# EAGLE design MotionerIMU (EAGLE 6.3)
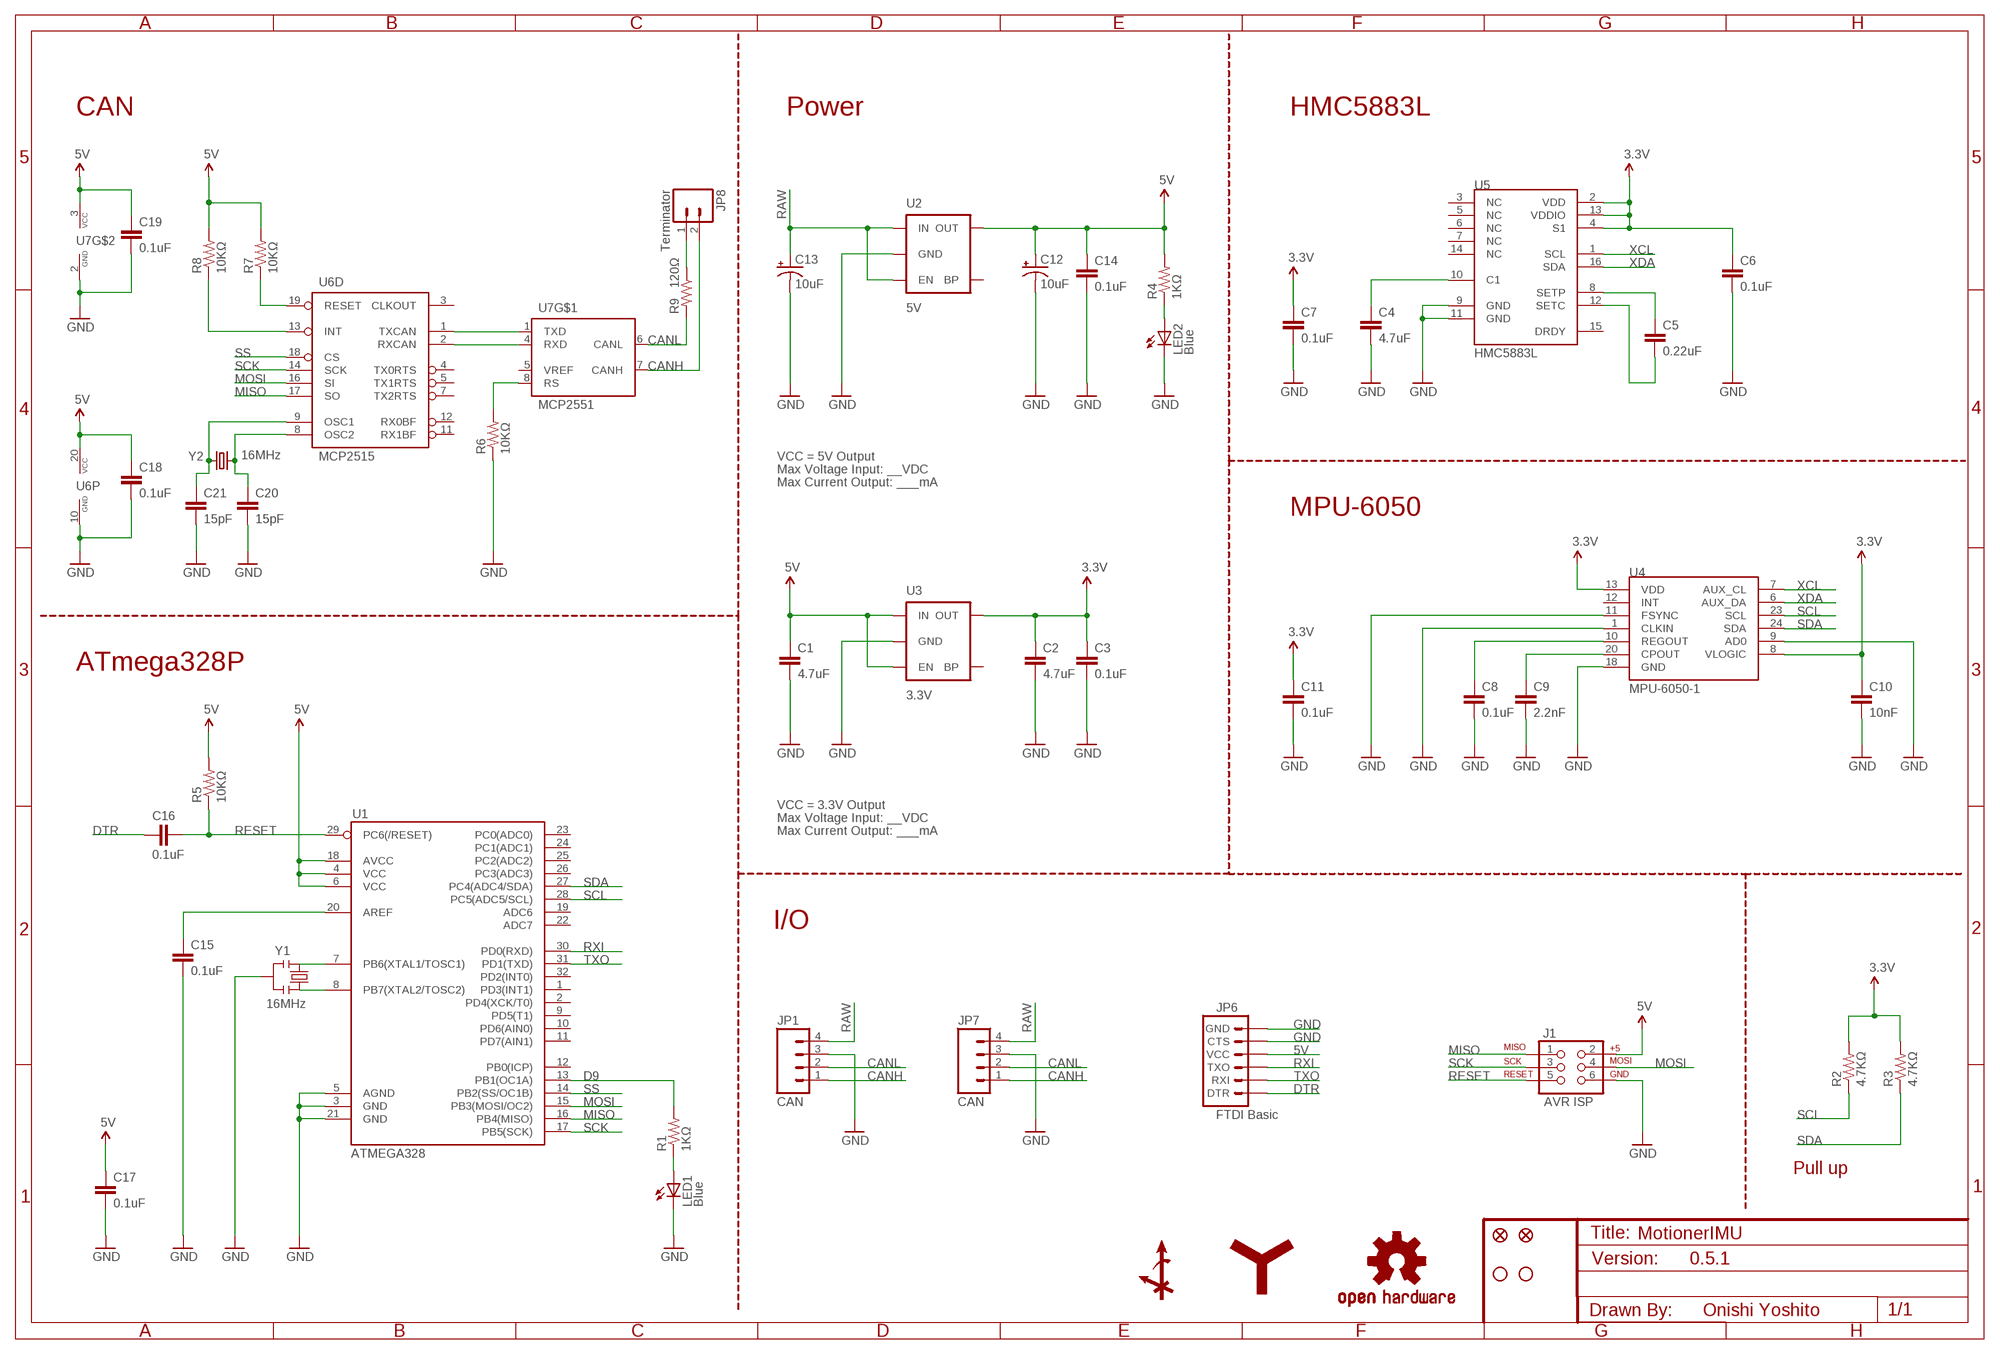
[diagram p0: schematic, sheet 1]

## Parts
C1  4.7uF  CAP0402-CAP  [0402-CAP]
C2  4.7uF  CAP0402-CAP  [0402-CAP]
C3  0.1uF  CAP0402-CAP  [0402-CAP]
C4  4.7uF  CAP0402-CAP  [0402-CAP]
C5  0.22uF  CAP0402-CAP  [0402-CAP]
C6  0.1uF  CAP0402-CAP  [0402-CAP]
C7  0.1uF  CAP0402-CAP  [0402-CAP]
C8  0.1uF  CAP0402-CAP  [0402-CAP]
C9  2.2nF  CAP0402-CAP  [0402-CAP]
C10  10nF  CAP0402-CAP  [0402-CAP]
C11  0.1uF  CAP0402-CAP  [0402-CAP]
C12  10uF  CAP_POL1206  [EIA3216]
C13  10uF  CAP_POL1206  [EIA3216]
C14  0.1uF  CAP0402-CAP  [0402-CAP]
C15  0.1uF  CAP0402-CAP  [0402-CAP]
C16  0.1uF  CAP0402-CAP  [0402-CAP]
C17  0.1uF  CAP0402-CAP  [0402-CAP]
C18  0.1uF  CAP0402-CAP  [0402-CAP]
C19  0.1uF  CAP0402-CAP  [0402-CAP]
C20  15pF  CAP0402-CAP  [0402-CAP]
C21  15pF  CAP0402-CAP  [0402-CAP]
J1  AVR ISP  AVR_SPI_PRG_6NS  [2X3-NS]
JP1  CAN  M04JST-PTH  [JST-4-PTH]
JP2  FIDUCIALUFIDUCIAL  [MICRO-FIDUCIAL]
JP3  STAND-OFFTIGHT  [STAND-OFF-TIGHT]
JP4  STAND-OFFTIGHT  [STAND-OFF-TIGHT]
JP5  FIDUCIALUFIDUCIAL  [MICRO-FIDUCIAL]
JP6  FTDI Basic  ARDUINO_SERIAL_PROGRAMPTH  [1X06]
JP7  CAN  M04JST-PTH  [JST-4-PTH]
JP8  Terminator  M02PTH  [1X02]
LED1  Blue  LED0603  [LED-0603]
LED2  Blue  LED0603  [LED-0603]
R1  1KΩ  RESISTOR0402-RES  [0402-RES]
R2  4.7KΩ  RESISTOR0402-RES  [0402-RES]
R3  4.7KΩ  RESISTOR0402-RES  [0402-RES]
R4  1KΩ  RESISTOR0402-RES  [0402-RES]
R5  10KΩ  RESISTOR0402-RES  [0402-RES]
R6  10KΩ  RESISTOR0402-RES  [0402-RES]
R7  10KΩ  RESISTOR0402-RES  [0402-RES]
R8  10KΩ  RESISTOR0402-RES  [0402-RES]
R9  120Ω  RESISTOR0402-RES  [0402-RES]
U1  ATMEGA328  ATMEGA168  [TQFP32-08]
U2  5V  V_REG_LDOSMD  [SOT23-5]
U3  3.3V  V_REG_LDOSMD  [SOT23-5]
U4  MPU-6050-1  [QFN-24-4MM2]
U5  HMC5883L  HMC5883LSMD  [16LPCC]
U6  MCP2515  MCP2515ST  [TSSOP20]
U7  MCP2551  MCP2551SO8  [SO08]
U$2  OSHW-LOGOS  [OSHW-LOGO-S]
U$11  AXIS-ANGLE_S  [AXIS-ANGLE_S]
U$13  YCAM_LOGO_L  [YCAM_LOGO_L]
Y1  16MHz  RESONATORSMD  [RESONATOR-SMD]
Y2  16MHz  CRYSTAL5X3  [CRYSTAL-SMD-5X3]

## Nets
3.3V [5V]: C2.1 C3.1 C6.1 C7.1 C10.1 C11.1 R2.2 R3.2 U3.5(OUT) U4.8(VLOGIC) U4.13(VDD) U5.2(VDD) U5.4(S1) U5.13(VDDIO)
5V [5V]: C1.1 C12.A(+) C14.1 C17.1 C18.1 C19.1 J1.2 JP6.4(VCC) R4.2 R5.2 R7.2 R8.2 U1.4(VCC) U1.6(VCC) U1.18(AVCC) U2.5(OUT) U3.1(IN) U3.3(EN) U6.20(P:VCC) U7.3(VCC)
CANH: JP1.1 JP7.1 JP8.2 U7.7(CANH)
CANL: JP1.2 JP7.2 R9.2 U7.6(CANL)
D9: R1.2 U1.13(PB1(OC1A))
DTR: C16.1 JP6.1(DTR)
GND [GND]: C1.2 C2.2 C3.2 C4.2 C6.2 C7.2 C8.2 C9.2 C10.2 C11.2 C12.C(-) C13.C(-) C14.2 C15.2 C17.2 C18.2 C19.2 C20.2 C21.2 J1.6 JP1.3 JP6.5(CTS) JP6.6(GND) JP7.3 LED1.C LED2.C R6.1 U1.3(GND) U1.5(AGND) U1.21(GND) U2.2(GND) U3.2(GND) U4.1(CLKIN) U4.9(AD0) U4.11(FSYNC) U4.18(GND) U5.9(GND) U5.11(GND) U6.10(P:GND) U7.2(GND) Y1.2
MISO: J1.1 U1.16(PB4(MISO)) U6.17(D:SO)
MOSI: J1.4 U1.15(PB3(MOSI/OC2)) U6.16(D:SI)
N$1: LED1.A R1.1
N$2: LED2.A R4.1
N$3: C4.1 U5.10(C1)
N$4: C5.1 U5.8(SETP)
N$5: C5.2 U5.12(SETC)
N$6: C9.1 U4.20(CPOUT)
N$7: C8.1 U4.10(REGOUT)
N$8: U1.7(PB6(XTAL1/TOSC1)) Y1.1
N$9: U1.8(PB7(XTAL2/TOSC2)) Y1.3
N$10: C15.1 U1.20(AREF)
N$11: U6.1(D:TXCAN) U7.1(TXD)
N$12: U6.2(D:RXCAN) U7.4(RXD)
N$13: R6.2 U7.8(RS)
N$14: R7.1 U6.19(D:RESET)
N$15: R8.1 U6.13(D:INT)
N$16: C20.1 U6.8(D:OSC2) Y2.3
N$17: C21.1 U6.9(D:OSC1) Y2.1
N$20: JP8.1 R9.1
RAW [RAW]: C13.A(+) JP1.4 JP7.4 U2.1(IN) U2.3(EN)
RESET: C16.2 J1.5 R5.1 U1.29(PC6(/RESET))
RXI: JP6.3(TXO) U1.30(PD0(RXD))
SCK: J1.3 U1.17(PB5(SCK)) U6.14(D:SCK)
SCL: R2.1 U1.28(PC5(ADC5/SCL)) U4.23(SCL)
SDA: R3.1 U1.27(PC4(ADC4/SDA)) U4.24(SDA)
SS: U1.14(PB2(SS/OC1B)) U6.18(D:CS)
TXO: JP6.2(RXI) U1.31(PD1(TXD))
XCL: U4.7(AUX_CL) U5.1(SCL)
XDA: U4.6(AUX_DA) U5.16(SDA)
Unconnected: U1.1(PD3(INT1)) U1.2(PD4(XCK/T0)) U1.9(PD5(T1)) U1.10(PD6(AIN0)) U1.11(PD7(AIN1)) U1.12(PB0(ICP)) U1.19(ADC6) U1.22(ADC7) U1.23(PC0(ADC0)) U1.24(PC1(ADC1)) U1.25(PC2(ADC2)) U1.26(PC3(ADC3)) U1.32(PD2(INT0)) U2.4(BP) U3.4(BP) U4.12(INT) U5.3(NC) U5.5(NC) U5.6(NC) U5.7(NC) U5.14(NC) U5.15(DRDY) U6.3(D:CLKOUT) U6.4(D:TX0RTS) U6.5(D:TX1RTS) U6.7(D:TX2RTS) U6.11(D:RX1BF) U6.12(D:RX0BF) U7.5(VREF)

## Notes on the sheet
- CAN | Power | HMC5883L
- VCC = 5V Output
- Max Voltage Input: __VDC
- Max Current Output: ___mA
- MPU-6050
- ATmega328P
- VCC = 3.3V Output
- Max Voltage Input: __VDC
- Max Current Output: ___mA
- I/O
- Pull up
- 0.5.1
- Onishi Yoshito

## Library data of the parts
C1-C11 C14-C21 = SparkFun-Passives:CAP: Capacitor Standard 0603 ceramic capacitor, and 0.1" leaded capacitor.
C12 C13 = SparkFun:CAP_POL: Capacitor Polarized These are standard SMD and PTH capacitors. Normally 10uF, 47uF, and 100uF in electrolytic and tantalum varieties. Always verify the external diameter of the through hole cap, it varies with capacity, voltage, and manufacturer. The EIA devices should be standard.
J1 = SparkFun-Connectors:AVR_SPI_PRG_6: AVR ISP 6 Pin This is the reduced ISP connector for AVR programming. Common on Arduino. This footprint will take up less PCB space and can be used with a 10-pin to 6-pin adapter such as SKU: BOB-08508
JP1 JP7 = SparkFun-Connectors:M04: Header 4 Standard 4-pin 0.1" header. Use with straight break away headers (SKU : PRT-00116), right angle break away headers (PRT-00553), swiss pins (PRT-00743), machine pins (PRT-00117), and female headers (PRT-00115). Molex polarized connector foot print use with SKU : PRT-08231 with associated crimp pins and housings. 1MM SMD Version SKU: PRT-10208
JP2 JP5 = SparkFun:FIDUCIAL: Fiducial Alignment Points Various fiducial points for machine vision alignment.
JP3 JP4 = SparkFun:STAND-OFF: Stand Off This is the mechanical footprint for a #4 phillips button head screw. Use the keepout ring to avoid running the screw head into surrounding components. SKU : PRT-00447
JP6 = SparkFun:ARDUINO_SERIAL_PROGRAM
JP8 = SparkFun-Connectors:M02: Header 2 Standard 2-pin 0.1" header. Use with straight break away headers (SKU : PRT-00116), right angle break away headers (PRT-00553), swiss pins (PRT-00743), machine pins (PRT-00117), and female headers (PRT-00115). Molex polarized connector foot print use with SKU : PRT-08233 with associated crimp pins and housings.
LED1 LED2 = SparkFun-LED:LED: LEDs Standard schematic elements and footprints for 5mm, 3mm, 1206, and 0603 sized LEDs. 5mm - Spark Fun Electronics SKU : COM-00529 (and others)
R1-R9 = SparkFun-Passives:RESISTOR: Resistor Basic schematic elements and footprints for 0603, 1206, and PTH resistors.
U1 = SparkFun:ATMEGA168
U2 U3 = SparkFun:V_REG_LDO: Voltage Regulator LDO Standard 150mA LDO voltage regulator in SOT-23 layout. Micrel part MIC5205. BP (by-pass) pin is used to lower output noise with 470pF cap.
U4 = Testing:MPU-6050
U5 = SparkFun-Sensors:HMC5883L: 3 Axis Digital Compass IC
U6 = can:MCP2515: MC2515 Stand-Alone CAN Controller With SPI Interface, Microchip
U7 = can:MCP2551: CAN Tranceiver Microchip
U$2 = SparkFun-Aesthetics:OSHW-LOGO: Open Source Hardware Logo This logo indicates the piece of hardware it is found on incorporates a OSHW license and/or adheres to the definition of open source hardware found here: http://freedomdefined.org/OSHW
U$11 = ram:AXIS-ANGLE_S
U$13 = ram:YCAM_LOGO_L
Y1 = SparkFun-FreqCtrl:RESONATOR: Resonator Small SMD resonator. This is the itty bitty 10/20MHz resonators with built in caps. CSTCE10M0G55 and CSTCE20M0V53. Footprint has been reviewed closely but hasn't been tested yet.
Y2 = SparkFun-FreqCtrl:CRYSTAL: Various standard crystals. Proven footprints. Spark Fun Electronics SKU : COM-00534

## Board
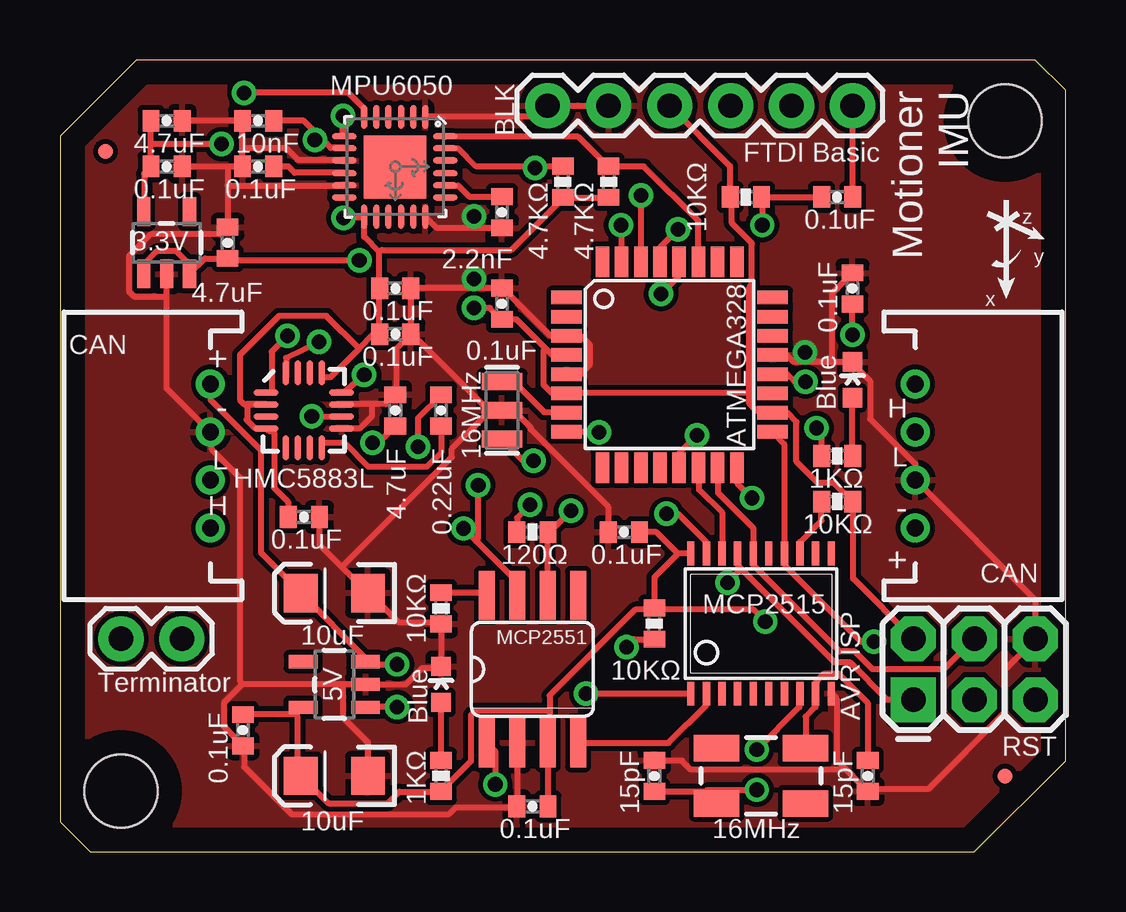
[diagram p1: board, top side]
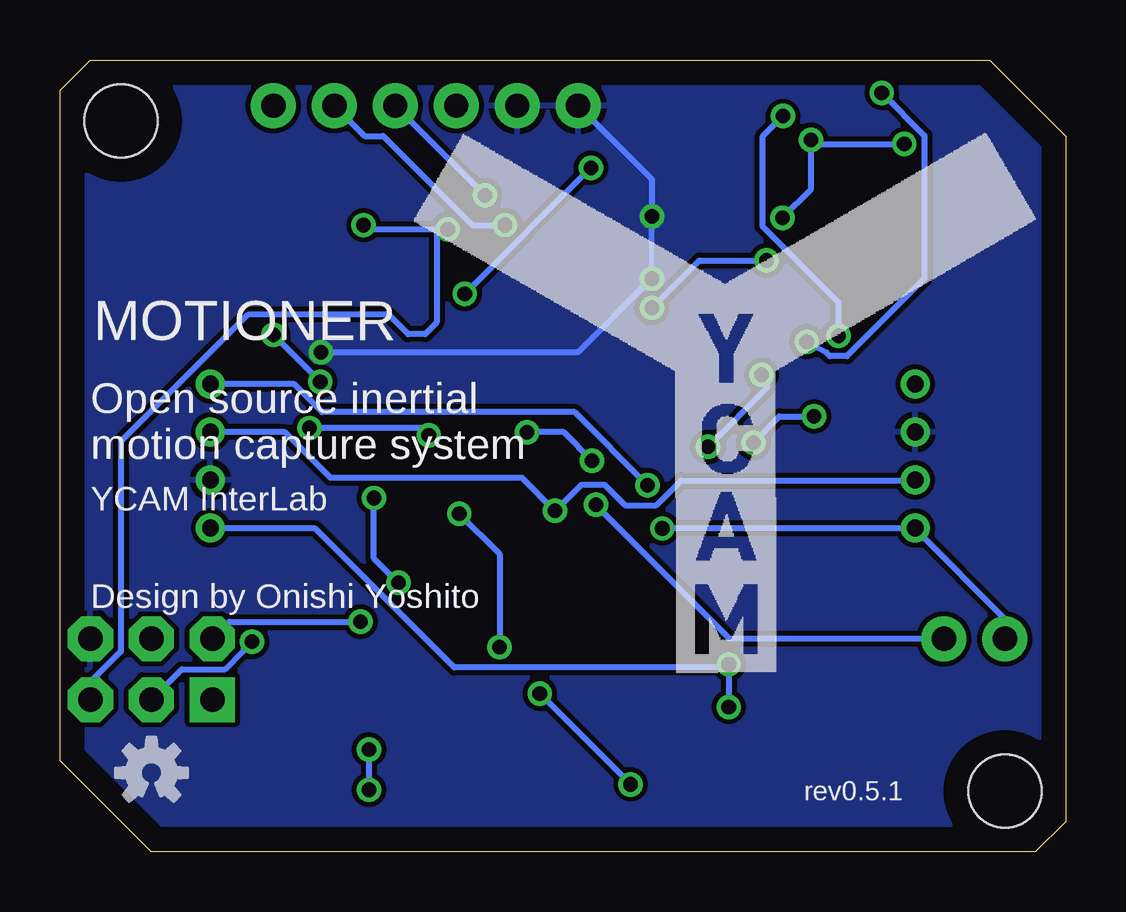
[diagram p2: board, bottom side, seen from below]

Size 41.91 x 33.02 mm. Coordinates in mm from the lower left corner, seen from the top.
Outline: 41.91,3.81 41.91,31.75 40.64,33.02 3.17,33.02 0,29.84 0,1.27 1.27,0 38.1,0 41.91,3.81
Copper layers (1*16): Top 0.035mm / dielectric 1.5mm / Bottom 0.035mm
Design rules "default": minimum track width 10mil, minimum drill 24mil, track to track 8mil, track to pad 8mil, pad to pad 8mil, via to via 8mil, smd to smd 8mil, copper to edge 40mil, drill to drill 8mil, minimum pad ring 10mil, minimum via ring 8mil, stop-mask expansion 4mil, vias tented up to drill 0mil, thermal gap 10mil

### Footprints (pad centres in the part's own frame; a part is rotated, then mirrored left to right if it is on the bottom)
0402-CAP = smd 0.7 x 0.9: 1 -0.65,0; 2 0.65,0
EIA3216 = smd 1.4 x 1.6: A 1.4,0; C -1.4,0
2X3-NS = drill 1.016 pad 1.88 square: 1 -2.54,-1.27 | drill 1.016 pad 1.88 octagon: 2 -2.54,1.27; 3 0,-1.27; 4 0,1.27; 5 2.54,-1.27; 6 2.54,1.27
JST-4-PTH = drill 0.7: 1 -3,-5; 2 -1,-5; 3 1,-5; 4 3,-5
MICRO-FIDUCIAL = smd 0.635 x 0.635: 1 0,0
STAND-OFF-TIGHT = hole 3.048: 0,0
1X06 = drill 1.016 pad 1.88: 1 0,0; 2 2.54,0; 3 5.08,0; 4 7.62,0; 5 10.16,0; 6 12.7,0
1X02 = drill 1.016 pad 1.88: 1 0,0; 2 2.54,0
LED-0603 = smd 0.8 x 0.8: A 0,-0.75; C 0,0.75
0402-RES = smd 0.7 x 0.9: 1 -0.65,0; 2 0.65,0
TQFP32-08 = smd 1.27 x 0.559: 1 -4.293,2.8; 2 -4.293,2; 3 -4.293,1.2; 4 -4.293,0.4; 5 -4.293,-0.4; 6 -4.293,-1.2; 7 -4.293,-2; 8 -4.293,-2.8; 17 4.293,-2.8; 18 4.293,-2; 19 4.293,-1.2; 20 4.293,-0.4; 21 4.293,0.4; 22 4.293,1.2; 23 4.293,2; 24 4.293,2.8 | smd 0.559 x 1.27: 9 -2.8,-4.293; 10 -2,-4.293; 11 -1.2,-4.293; 12 -0.4,-4.293; 13 0.4,-4.293; 14 1.2,-4.293; 15 2,-4.293; 16 2.8,-4.293; 25 2.8,4.293; 26 2,4.293; 27 1.2,4.293; 28 0.4,4.293; 29 -0.4,4.293; 30 -1.2,4.293; 31 -2,4.293; 32 -2.8,4.293
SOT23-5 = smd 0.55 x 1.2: 1 -0.95,-1.3; 2 0,-1.3; 3 0.95,-1.3; 4 0.95,1.3; 5 -0.95,1.3
QFN-24-4MM2 = smd 1.016 x 0.254: 1 -2.066,1.257; 2 -2.066,0.75; 3 -2.066,0.247; 4 -2.066,-0.287; 5 -2.066,-0.792; 6 -2.066,-1.297; 13 2.086,-1.297; 14 2.086,-0.792; 15 2.086,-0.287; 16 2.086,0.247; 17 2.086,0.75; 18 2.086,1.257 | smd 0.254 x 1.016: 7 -1.267,-2.122; 8 -0.762,-2.122; 9 -0.258,-2.122; 10 0.278,-2.122; 11 0.78,-2.122; 12 1.287,-2.122; 19 1.287,2.082; 20 0.78,2.082; 21 0.278,2.082; 22 -0.258,2.082; 23 -0.762,2.082; 24 -1.267,2.082 | smd 2.616 x 2.616: P$1 0.02,-0.01
16LPCC = smd 1.05 x 0.28: 1 -1.57,0.75; 2 -1.57,0.25; 3 -1.57,-0.25; 4 -1.57,-0.75; 9 1.57,-0.75; 10 1.57,-0.25; 11 1.57,0.25; 12 1.57,0.75 | smd 0.28 x 1.05: 5 -0.75,-1.57; 6 -0.25,-1.57; 7 0.25,-1.57; 8 0.75,-1.57; 13 0.75,1.57; 14 0.25,1.57; 15 -0.25,1.57; 16 -0.75,1.57
TSSOP20 = smd 0.305 x 0.991: 1 -2.925,-2.918; 2 -2.275,-2.918; 3 -1.625,-2.918; 4 -0.975,-2.918; 5 -0.325,-2.918; 6 0.325,-2.918; 7 0.975,-2.918; 8 1.625,-2.918; 9 2.275,-2.918; 10 2.925,-2.918; 11 2.925,2.918; 12 2.275,2.918; 13 1.625,2.918; 14 0.975,2.918; 15 0.325,2.918; 16 -0.325,2.918; 17 -0.975,2.918; 18 -1.625,2.918; 19 -2.275,2.918; 20 -2.925,2.918
SO08 = smd 0.66 x 2.032: 1 -1.905,-3.073; 2 -0.635,-3.073; 3 0.635,-3.073; 4 1.905,-3.073; 5 1.905,3.073; 6 0.635,3.073; 7 -0.635,3.073; 8 -1.905,3.073
RESONATOR-SMD = smd 0.7 x 1.7: 1 -1.2,0; 2 0,0; 3 1.2,0
CRYSTAL-SMD-5X3 = smd 1.9 x 1.1: 1 -1.85,-1.15; 2 1.85,-1.15; 3 1.85,1.15; 4 -1.85,1.15

### Placement (x,y rotation side)
C1  6.99,25.4 90 top
C2  4.45,30.48 0 top
C3  4.45,28.57 0 top
C4  13.97,18.41 90 top
C5  15.88,18.41 90 top
C6  13.97,21.59 0 top
C7  10.16,13.97 0 top
C8  8.26,28.57 180 top
C9  18.41,26.67 270 top
C10  8.26,30.48 180 top
C11  13.97,23.5 0 top
C12  11.43,3.17 180 top
C13  11.43,10.79 180 top
C14  7.62,5.08 270 top
C15  33.02,23.5 90 top
C16  32.38,27.3 180 top
C17  18.41,22.86 90 top
C18  23.5,13.34 180 top
C19  19.68,1.91 180 top
C20  24.77,3.17 90 top
C21  33.66,3.17 270 top
J1  38.1,7.62 0 top
JP1  40.64,16.51 270 top
JP2  1.91,29.21 180 top
JP3  39.37,30.48 180 top
JP4  2.54,2.54 180 top
JP5  39.37,3.17 180 top
JP6  33.02,31.11 180 top
JP7  1.27,16.51 90 top
JP8  5.08,8.89 180 top
LED1  33.02,19.68 0 top
LED2  15.88,6.99 0 top
R1  32.38,16.51 180 top
R2  20.95,27.94 270 top
R3  22.86,27.94 270 top
R4  15.88,3.17 270 top
R5  28.57,27.3 180 top
R6  15.88,10.16 90 top
R7  24.77,9.53 90 top
R8  32.38,14.61 0 top
R9  19.68,13.34 0 top
U1  25.4,20.32 0 top
U2  11.43,6.99 90 top
U3  4.45,25.4 0 top
U4  13.97,28.57 270 top
U5  10.16,18.41 0 top
U6  29.21,9.53 0 top
U7  19.68,7.62 0 top
U$2  38.1,3.3 0 bottom
U$11  41.02,27.18 180 top
U$13  27.18,5.71 0 bottom
Y1  18.41,18.41 270 top
Y2  29.21,3.17 180 top

### Tracks (layer width: path | path; a pad name or v marks a point on that pad's centre or on a via)
3.3V  (via drill 0.61)
  Top 0.254: C7.1 9.51,14.59 8.92,15.18 8.92,17.47 8.84,17.55 8.7,17.55 U5.4 8.12,17.66 7.78,18.01 7.78,18.04 7.8,18.06 7.8,18.64 7.77,18.67 U5.2 7.67,18.66 7.49,18.85 7.49,19.5 7.49,19.51 7.49,20.73 9.12,22.35 11.1,22.35 12.46,20.99 | 3.79,29.52 3.79,28.57 C3.1 3.71,28.47 3.5,28.27 3.5,26.72 U3.5 | 3.79,29.52 3.79,30.48 C2.1 | C10.1 10.16,30.48 10.78,29.86 | 10.78,29.86 11.28,29.36 11.84,29.36 U4.8 | R3.2 R2.2 20.88,27.18 18.8,25.09 13.41,25.09 13.31,25.02 | 12.46,20.99 13.06,21.59 C6.1 13.31,21.69 C11.1 13.31,23.6 13.31,25.02 | 12.46,20.99 11.25,19.79 10.92,19.79 U5.13 | 13.31,25.02 12.68,25.65 12.68,26.47 U4.13 12.57,26.44 v11.81,26.44 | v10.62,29.69 10.78,29.86 | v6.73,29.52 3.79,29.52
  Bottom 0.254: v11.81,26.44 10.62,27.64 v10.62,29.69 10.52,29.52 v6.73,29.52
5V  (via drill 0.61)
  Top 0.254: 9.83,5.74 C14.1 | 9.83,5.74 10.11,6.02 U2.5 | 9.83,5.74 9.91,5.64 9.91,3.23 C12.A 11.18,2.03 13.66,2.03 14.15,2.52 R4.2 15.95,2.62 17.12,3.79 17.12,5.71 17.3,5.89 20.4,5.89 | C19.1 U7.3 20.4,4.65 20.4,5.89 | C18.1 24.84,13.34 25.73,12.45 | 25.73,12.45 26.26,12.45 U6.20 | R7.2 24.77,11.46 25.65,12.34 25.73,12.45 | 20.4,5.89 20.4,6.53 23.98,10.11 24.66,10.11 R7.2 | U3.1 3.5,24.51 4.04,25.04 4.85,25.04 5.51,24.38 U3.3 6.04,24.74 C1.1 7.09,24.66 v12.47,24.66 | 20.23,20.99 20.5,20.73 U1.4 | 20.23,20.99 19.02,22.2 C17.1 18.31,22.28 17.91,22.68 v17.25,22.68 | 20.23,20.99 20.14,20.9 20.14,19.48 20.5,19.13 U1.6 21.21,19.13 28.73,19.13 | JP6.4 27.91,28.6 27.91,27.3 R5.2 27.99,27.2 27.99,26.21 28.83,25.38 28.83,23.65 28.73,23.55 28.73,19.13 | J1.2 33.05,11.4 33.05,14.61 R8.2 32.94,14.68 32.23,15.39 31.57,15.39 30.68,16.28 30.68,17.93 30.3,18.31 U1.18 29.59,18.39 29.03,18.39 28.73,18.69 28.73,19.13 | v29.39,9.6 28.88,10.11 24.87,10.11 R7.2
  Bottom 0.254: v12.47,24.66 15.27,24.66 v17.25,22.68 | v29.39,9.6 34.85,9.6 J1.2
CANH  (via drill 0.61)
  Top 0.254: U7.7 19.05,11.25 17.34,12.97 | v16.82,13.49 17.34,12.97 | v17.42,15.29 17.42,13.06 17.34,12.97
  Bottom 0.254: v16.82,13.49 6.27,13.49 JP7.1 6.2,13.39 2.54,9.73 JP8.2 | v17.42,15.29 20.47,18.34 30.99,18.34 32.16,19.51 JP1.1
CANL  (via drill 0.61)
  Top 0.254: U7.6 R9.2 20.45,13.39 v21.29,14.22
  Bottom 0.254: JP1.2 32.54,17.5 30.63,15.6 22.66,15.6 v21.29,14.22 21.18,14.3 20.17,15.32 19.23,15.32 18.36,14.45 17.07,14.45 16.03,15.49 6.27,15.49 JP7.2
D9  (via drill 0.61)
  Top 0.254: v31.52,17.68 31.73,17.48 R1.2 | v26.54,17.37 25.81,16.64 U1.13
  Bottom 0.254: v31.52,17.68 26.85,17.68 v26.54,17.37
DTR
  Top 0.254: JP6.1 C16.1
GND  (via drill 0.61)
  Top 0.254: 32.68,3.52 32.36,3.83 32.36,6.4 32.16,6.6 U6.10 | 32.68,3.52 33.66,2.54 C21.2 33.76,2.62 36.17,2.62 39.37,5.82 39.37,7.59 40.56,8.79 J1.6 40.64,10.52 35.74,15.42 JP1.3 35.64,16.18 33.76,18.06 33.76,19.63 33.07,20.32 LED1.C 33.02,20.45 32.18,20.45 | C20.2 25.91,3.81 26.29,3.43 32.59,3.43 32.68,3.52 | 31.04,20.45 30.56,20.45 30.3,20.7 29.69,20.7 U1.21 | 31.04,20.45 32.18,20.45 | 32.18,20.45 32.18,23.29 C15.2 | 17.25,26.04 15.67,26.04 15.24,26.47 U4.18 | 17.25,26.04 18.41,26.04 C9.2 | U4.1 15.24,30.66 19.86,30.66 JP6.6 JP6.5 | v17.25,26.49 17.25,26.04 | Y1.2 18.9,18.41 19.61,17.7 19.61,17.63 22.84,14.4 22.84,13.34 C18.2 | 13,18.67 13.59,18.67 C4.2 14.02,19.18 14.02,20.98 14.53,21.49 C6.2 | 13,18.67 11.53,18.67 U5.11 | U5.9 11.53,17.68 11.99,17.68 12,17.67 12.5,17.67 13,18.17 13,18.67 | 17.25,23.52 14.66,23.52 C11.2 14.61,23.39 14.61,21.59 C6.2 | 17.25,23.52 C17.2 18.52,23.44 20.42,21.54 21.11,21.54 U1.3 21.21,21.46 21.77,21.46 22.07,21.16 22.07,20.3 21.72,19.94 21.11,19.94 U1.5 | Y1.2 18.31,18.49 17.78,18.49 14.73,21.54 C6.2 | 17.25,23.52 v17.25,23.9 | 4.45,23.16 4.45,19.33 6.25,17.53 JP7.3 6.33,17.4 6.33,16.79 7.52,15.6 7.52,7.09 7.59,6.99 | 4.45,23.16 U3.2 | 7.59,29.36 7.59,28.57 C8.2 6.99,28.57 | 7.59,29.36 7.59,30.48 C10.2 C2.2 | 6.99,28.57 C3.2 | 6.99,28.57 6.99,27.79 | 6.99,27.79 C1.2 6.88,25.98 6.66,25.76 3.79,25.76 2.87,24.84 2.87,23.37 3.07,23.16 4.45,23.16 | 7.59,29.36 9.4,29.36 9.91,28.85 11.84,28.85 U4.9 | 6.99,27.79 11.84,27.79 U4.11 | 11.75,11.87 C13.C 12.95,10.74 14.12,9.58 15.77,9.58 R6.1 LED2.C 15.77,7.67 15.09,7.67 14.4,6.99 U2.2 11.79,6.99 | 11.75,11.87 10.82,12.8 C7.2
  Top 0.254: U7.2 C19.2 18.92,1.85 16.48,1.85 16.2,1.57 9.65,1.57 7.67,3.56 7.67,4.32 C14.2 7.62,4.45 6.83,5.23 6.83,6.22 7.59,6.99 | 11.79,6.99 7.59,6.99 | 11.79,6.99 11.79,5.61 12.83,4.57 C12.C | 11.75,11.87 16.33,16.46 16.33,16.82 17.7,18.19 17.7,18.39 Y1.2 | v31.04,20.83 31.04,20.45
  Bottom 0.254: JP6.6 17.25,28.04 v17.25,26.49 v17.25,23.9 17.35,23.82 20.34,20.83 v31.04,20.83
  pour Bottom: 41.91,3.81 41.91,31.75 40.64,33.02 3.17,33.02 0,29.84 0,1.27 1.27,0 38.1,0
  pour Top: 41.91,3.81 41.91,31.75 40.64,33.02 3.17,33.02 0,29.84 0,1.27 1.27,0 38.1,0
MISO  (via drill 0.61)
  Top 0.254: 28.38,11.8 32.28,7.9 32.92,7.9 34.47,6.35 J1.1 | 28.38,11.8 28.25,11.94 28.25,12.42 U6.17 | v28.83,14.76 28.22,15.37 28.22,16.03 U1.16 | 28.38,11.8 v27.81,11.23
  Bottom 0.254: v28.83,14.76 28.83,12.24 v27.81,11.23
MOSI
  Top 0.254: U1.15 27.41,14.99 28.88,13.51 U6.16 28.91,12.32 28.91,11.94 32.49,8.36 33.12,8.36 33.86,7.62 36.83,7.62 J1.4
N$1
  Top 0.254: LED1.A R1.1
N$2
  Top 0.254: R4.1 LED2.A
N$3  (via drill 0.61)
  Top 0.254: v10.49,18.16 11.51,18.16 U5.10 | v13.02,17.06 13.51,17.3 13.97,17.75 C4.1
  Bottom 0.254: v10.49,18.16 11.94,18.16 v13.02,17.06
N$4
  Top 0.254: C5.1 15.88,16.66 15.27,16.05 12.85,16.05 11.86,17.04 10.92,17.04 U5.8
N$5  (via drill 0.61)
  Top 0.254: v12.68,19.89 11.84,19.18 11.53,19.18 U5.12 | v14.91,16.89 14.91,18.09 C5.2
  Bottom 0.254: v14.91,16.89 12.42,19.38 v12.68,19.89
N$6
  Top 0.254: C9.1 17.04,27.33 16.59,27.79 16.05,27.79 U4.20
N$7
  Top 0.254: C8.1 9.53,28.57 9.78,28.32 11.84,28.32 U4.10
N$8
  Top 0.254: U1.7 21.11,18.34 20.17,18.34 18.9,19.61 Y1.1
N$9  (via drill 0.61)
  Top 0.254: v22.45,17.5 21.11,17.5 U1.8 | v19.74,16.31 19.3,16.31 18.41,17.2 Y1.3
  Bottom 0.254: v22.45,17.5 20.93,17.5 v19.74,16.31
N$10  (via drill 0.61)
  Top 0.254: v33.02,21.57 C15.1 | v31.06,19.61 30.61,19.61 30.3,19.91 U1.20
  Bottom 0.254: v31.06,19.61 v33.02,21.57
N$11  (via drill 0.61)
  Top 0.254: v21.92,6.6 26.26,6.6 U6.1 | v18.14,2.82 18.14,4.19 U7.1
  Bottom 0.254: v18.14,2.82 v21.92,6.6
N$12
  Top 0.254: U7.4 25.35,4.55 26.92,6.12 26.92,6.6 U6.2
N$13
  Top 0.254: U7.8 17.68,10.79 15.88,10.79 R6.2
N$14  (via drill 0.61)
  Top 0.254: v23.6,8.53 23.93,8.87 24.77,8.87 R7.1 | v25.27,14.1 25.76,14.1 26.92,12.93 26.92,12.45 U6.19
  Bottom 0.254: v23.6,8.53 23.6,12.42 v25.27,14.1
N$15
  Top 0.254: R8.1 31.73,13.82 30.84,12.93 U6.13
N$16  (via drill 0.61)
  Top 0.254: 26.87,2.52 C20.1 | 26.87,2.52 27.36,2.03 Y2.3 | v29.03,4.27 30.81,6.04 30.81,6.6 U6.8 | v29.03,2.59 26.98,2.59 26.87,2.52
  Bottom 0.254: v29.03,2.59 v29.03,4.27
N$17
  Top 0.254: C21.1 33.66,6.22 32.44,7.44 31.85,7.44 31.5,7.09 31.5,6.63 U6.9 31.47,6.48 31.47,6.04 31.06,5.64 31.06,4.34 Y2.1
N$20  (via drill 0.61)
  Top 0.254: v19.58,14.48 19.05,13.95 R9.1
  Bottom 0.254: v19.58,14.48 13.99,8.89 JP8.1
RAW  (via drill 0.61)
  Top 0.254: v14.05,6.04 12.75,6.04 U2.1 | v14.05,7.82 12.78,7.82 U2.3 12.72,8.1 C13.A 9.96,10.9 8.38,12.47 8.38,16.74 6.27,18.85 JP7.4
  Bottom 0.254: v14.05,6.04 v14.05,7.82 14.15,7.7 25.48,7.7 31.27,13.49 35.64,13.49 JP1.4
RESET  (via drill 0.61)
  Top 0.254: C16.2 R5.1 29.26,27.2 v29.26,26.14 | v25.76,25.96 25.02,25.22 25.02,24.61 U1.29
  Bottom 0.254: v29.26,26.14 29.08,25.96 v25.76,25.96 26.21,25.86 26.21,22.07 26.7,21.59 27.41,21.59 28.22,22.4 34.09,22.4 39.37,17.12 39.37,8.36 40.64,7.09 J1.5
RXI  (via drill 0.61)
  Top 0.254: v24.21,27.38 U1.30
  Bottom 0.254: JP6.3 v24.21,27.38
SCK  (via drill 0.61)
  Top 0.254: U1.17 29.69,17.5 30.18,17.02 30.18,12.45 U6.14 30.2,12.32 30.2,11.94 33.38,8.76 v33.91,8.76
  Bottom 0.254: v33.91,8.76 34.29,8.38 34.29,8.36 35.03,7.62 36.83,7.62 J1.3
SCL  (via drill 0.61)
  Top 0.254: 19.79,28.6 17.32,28.6 16.59,29.34 U4.23 | 19.79,28.6 R2.1 | v25.04,23.27 25.78,24 25.78,24.61 U1.28 | v19.79,28.52 19.79,28.6
  Bottom 0.254: v19.79,28.52 v25.04,23.27
SDA
  Top 0.254: U1.27 26.59,26.31 24.33,28.57 22.86,28.57 R3.1 22.76,28.65 21.59,29.82 16.05,29.82 U4.24
SS
  Top 0.254: U6.18 27.58,14.15 26.62,15.11 26.62,16.03 U1.14
TXO  (via drill 0.61)
  Top 0.254: v23.37,26.14 23.39,26.11 U1.31
  Bottom 0.254: v23.37,26.14 24.74,26.14 28.45,29.84 29.21,29.84 JP6.2
XCL  (via drill 0.61)
  Top 0.254: v9.47,21.51 8.81,20.85 8.81,19.18 U5.1 | v11.79,30.68 11.79,29.92 11.86,29.84 U4.7
  Bottom 0.254: v9.47,21.51 9.47,22.91 12.65,26.09 12.65,29.82 v11.79,30.68
XDA  (via drill 0.61)
  Top 0.254: v7.67,31.65 12.01,31.65 12.65,31.01 12.65,30.66 U4.6 | U5.16 9.42,19.79 9.42,20.24 9.42,20.6 v10.8,21.27
  Bottom 0.254: v10.8,21.27 9.98,20.83 9.83,20.68 9.12,20.68 5.89,23.9 5.89,29.87 v7.67,31.65

### Text on the board
tPlace: Motioner / IMU | z | y | x
bPlace: MOTIONER | Open source inertial / motion capture system | YCAM InterLab | Design by Onishi Yoshito | rev0.5.1
tNames: MPU6050 | BLK | + | - | H | L | L | H | - | + | RST